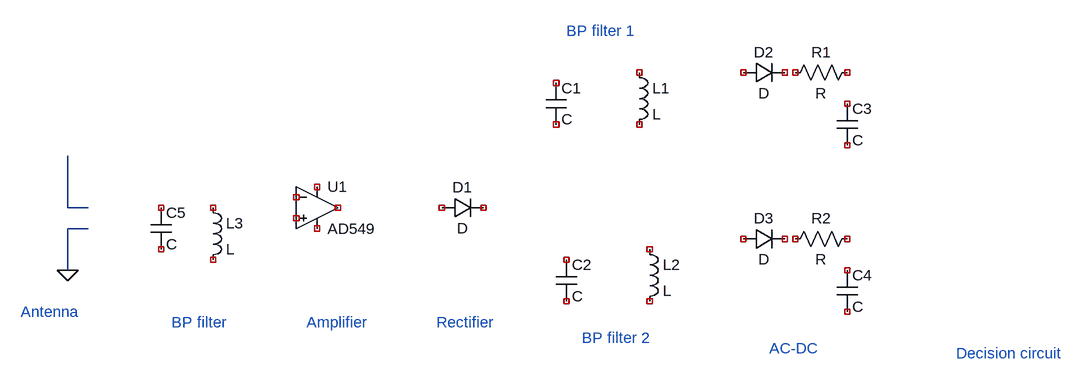
[diagram p0: schematic demodulador-colpin.asc]
demodulador-colpin.asc, the LTspice schematic file:
Version 4
SHEET 1 1436 680
WIRE -112 112 -112 32
WIRE -80 112 -112 112
WIRE -80 144 -112 144
WIRE -112 208 -112 144
FLAG -112 208 0
SYMBOL OpAmps\\AD549 272 48 R0
SYMATTR InstName U1
SYMBOL diode 464 128 R270
WINDOW 0 32 32 VTop 2
WINDOW 3 0 32 VBottom 2
SYMATTR InstName D1
SYMBOL cap 624 -80 R0
SYMATTR InstName C1
SYMBOL cap 640 192 R0
SYMATTR InstName C2
SYMBOL ind 752 -112 R0
SYMATTR InstName L1
SYMBOL ind 768 160 R0
SYMATTR InstName L2
SYMBOL cap 1072 -48 R0
SYMATTR InstName C3
SYMBOL diode 928 -80 R270
WINDOW 0 32 32 VTop 2
WINDOW 3 0 32 VBottom 2
SYMATTR InstName D2
SYMBOL res 992 -80 R270
WINDOW 0 32 56 VTop 2
WINDOW 3 0 56 VBottom 2
SYMATTR InstName R1
SYMBOL cap 1072 208 R0
SYMATTR InstName C4
SYMBOL diode 928 176 R270
WINDOW 0 32 32 VTop 2
WINDOW 3 0 32 VBottom 2
SYMATTR InstName D3
SYMBOL res 992 176 R270
WINDOW 0 32 56 VTop 2
WINDOW 3 0 56 VBottom 2
SYMATTR InstName R2
SYMBOL ind 96 96 R0
SYMATTR InstName L3
SYMBOL cap 16 112 R0
SYMATTR InstName C5
TEXT -184 272 Left 2 ;Antenna
TEXT 256 288 Left 2 ;Amplifier
TEXT 48 288 Left 2 ;BP filter
TEXT 456 288 Left 2 ;Rectifier
TEXT 656 -160 Left 2 ;BP filter 1
TEXT 680 312 Left 2 ;BP filter 2
TEXT 968 328 Left 2 ;AC-DC
TEXT 1256 336 Left 2 ;Decision circuit

The netlist it stands for:
* demodulador-colpin.asc
XU1 NC_01 NC_02 NC_03 NC_04 NC_05 AD549  ; pins In+ In- V+ V- OUT
D1 NC_06 NC_07 D
C1 NC_08 NC_09 C
C2 NC_10 NC_11 C
L1 NC_12 NC_13 L
L2 NC_14 NC_15 L
C3 NC_16 NC_17 C
D2 NC_18 NC_19 D
R1 NC_20 NC_21 R
C4 NC_22 NC_23 C
D3 NC_24 NC_25 D
R2 NC_26 NC_27 R
L3 NC_28 NC_29 L
C5 NC_30 NC_31 C
.model D D
.lib standard.dio
* Antenna
* Amplifier
* BP filter
* Rectifier
* BP filter 1
* BP filter 2
* AC-DC
* Decision circuit
.backanno
.end